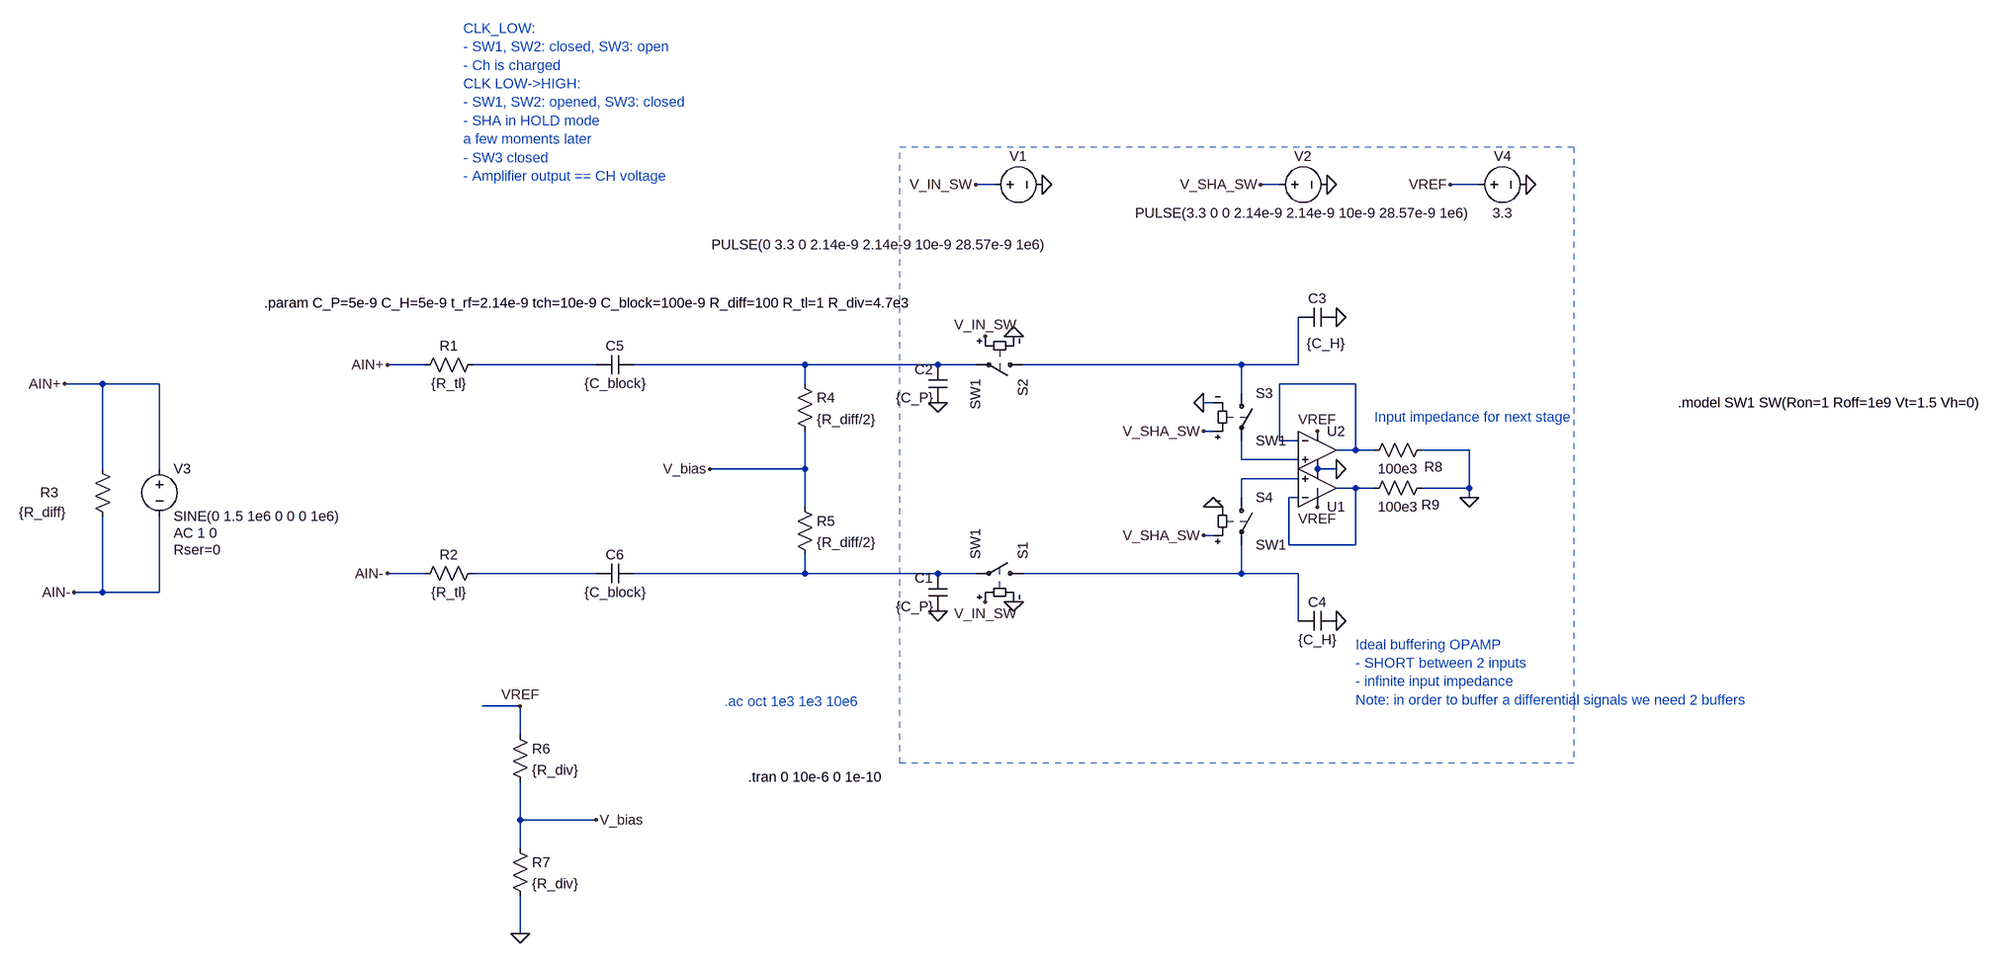
[diagram p0: schematic adc_analog_input.asc]
adc_analog_input.asc, the LTspice schematic file:
Version 4
SHEET 1 1884 948
WIRE 48 -384 16 -384
WIRE 528 -384 496 -384
WIRE 864 -384 816 -384
WIRE -912 -80 -976 -80
WIRE -624 -80 -832 -80
WIRE -272 -80 -560 -80
WIRE -48 -80 -272 -80
WIRE 16 -80 -48 -80
WIRE 464 -80 96 -80
WIRE 560 -80 560 -160
WIRE 560 -80 464 -80
WIRE -1456 -48 -1520 -48
WIRE -1360 -48 -1456 -48
WIRE -272 -48 -272 -80
WIRE 656 -48 528 -48
WIRE 464 -32 464 -80
WIRE 416 -16 400 -16
WIRE 416 32 400 32
WIRE 528 48 528 -48
WIRE 560 48 528 48
WIRE 656 64 656 -48
WIRE 656 64 624 64
WIRE 688 64 656 64
WIRE 848 64 768 64
WIRE 464 80 464 48
WIRE 560 80 464 80
WIRE -1456 96 -1456 -48
WIRE -1360 96 -1360 -48
WIRE -272 96 -272 32
WIRE -272 96 -432 96
WIRE 624 96 592 96
WIRE 560 112 464 112
WIRE 656 128 624 128
WIRE 688 128 656 128
WIRE 848 128 848 64
WIRE 848 128 768 128
WIRE 464 144 464 112
WIRE 560 144 544 144
WIRE 848 144 848 128
WIRE -272 160 -272 96
WIRE 592 160 592 128
WIRE 416 208 400 208
WIRE 544 224 544 144
WIRE 656 224 656 128
WIRE 656 224 544 224
WIRE -912 272 -976 272
WIRE -624 272 -832 272
WIRE -272 272 -272 240
WIRE -272 272 -560 272
WIRE -48 272 -272 272
WIRE 16 272 -48 272
WIRE 464 272 464 224
WIRE 464 272 96 272
WIRE 560 272 464 272
WIRE -1456 304 -1456 176
WIRE -1456 304 -1504 304
WIRE -1360 304 -1360 176
WIRE -1360 304 -1456 304
WIRE 560 352 560 272
WIRE -752 496 -816 496
WIRE -752 544 -752 496
WIRE -752 688 -752 624
WIRE -624 688 -752 688
WIRE -752 736 -752 688
WIRE -752 880 -752 816
FLAG -976 -80 AIN+
FLAG -976 272 AIN-
FLAG -48 336 0
FLAG -48 -16 0
FLAG 80 -128 0
FLAG 80 320 0
FLAG 32 -128 V_IN_SW
FLAG 32 320 V_IN_SW
FLAG 128 -384 0
FLAG 16 -384 V_IN_SW
FLAG 608 -384 0
FLAG 496 -384 V_SHA_SW
FLAG 400 -16 0
FLAG 400 32 V_SHA_SW
FLAG 624 -160 0
FLAG 624 352 0
FLAG -1520 -48 AIN+
FLAG -1504 304 AIN-
FLAG -752 880 0
FLAG -624 688 V_bias
FLAG -432 96 V_bias
FLAG 944 -384 0
FLAG 816 -384 VREF
FLAG -752 496 VREF
FLAG 624 96 0
FLAG 848 144 0
FLAG 400 208 V_SHA_SW
FLAG 416 160 0
FLAG 592 160 VREF
FLAG 592 32 VREF
DATAFLAG 816 64 ""
SYMBOL sw 112 272 M270
SYMATTR InstName S1
SYMATTR Value SW1
SYMBOL sw 112 -80 R90
SYMATTR InstName S2
SYMATTR Value SW1
SYMBOL voltage 32 -384 R270
WINDOW 0 32 56 VTop 2
WINDOW 3 -117 -178 VTop 2
WINDOW 123 0 0 Left 0
WINDOW 39 0 0 Left 0
SYMATTR InstName V1
SYMATTR Value PULSE(0 3.3 0 2.14e-9 2.14e-9 10e-9 28.57e-9 1e6)
SYMBOL cap -32 336 R180
WINDOW 0 24 56 Left 2
WINDOW 3 24 8 Left 2
SYMATTR InstName C1
SYMATTR Value {C_P}
SYMBOL cap -32 -16 R180
WINDOW 0 24 56 Left 2
WINDOW 3 24 8 Left 2
SYMATTR InstName C2
SYMATTR Value {C_P}
SYMBOL voltage 512 -384 R270
WINDOW 0 32 56 VTop 2
WINDOW 3 -32 56 VBottom 2
WINDOW 123 0 0 Left 0
WINDOW 39 0 0 Left 0
SYMATTR InstName V2
SYMATTR Value PULSE(3.3 0 0 2.14e-9 2.14e-9 10e-9 28.57e-9 1e6)
SYMBOL sw 464 -48 R0
SYMATTR InstName S3
SYMATTR Value SW1
SYMBOL cap 624 -176 R90
WINDOW 0 0 32 VBottom 2
WINDOW 3 44 18 VTop 2
SYMATTR InstName C3
SYMATTR Value {C_H}
SYMBOL cap 624 336 R90
WINDOW 0 0 32 VBottom 2
WINDOW 3 32 32 VTop 2
SYMATTR InstName C4
SYMATTR Value {C_H}
SYMBOL voltage -1360 80 R0
WINDOW 123 24 124 Left 2
WINDOW 39 24 152 Left 2
SYMATTR Value2 AC 1 0
SYMATTR SpiceLine Rser=0
SYMATTR InstName V3
SYMATTR Value SINE(0 1.5 1e6 0 0 0 1e6)
SYMBOL res -816 -96 R90
WINDOW 0 0 56 VBottom 2
WINDOW 3 32 56 VTop 2
SYMATTR InstName R1
SYMATTR Value {R_tl}
SYMBOL res -816 256 R90
WINDOW 0 0 56 VBottom 2
WINDOW 3 32 56 VTop 2
SYMATTR InstName R2
SYMATTR Value {R_tl}
SYMBOL res -1472 80 R0
WINDOW 0 -89 56 Left 2
WINDOW 3 -125 89 Left 2
SYMATTR InstName R3
SYMATTR Value {R_diff}
SYMBOL res -288 -64 R0
SYMATTR InstName R4
SYMATTR Value {R_diff/2}
SYMBOL cap -560 -96 R90
WINDOW 0 0 32 VBottom 2
WINDOW 3 32 32 VTop 2
SYMATTR InstName C5
SYMATTR Value {C_block}
SYMBOL cap -560 256 R90
WINDOW 0 0 32 VBottom 2
WINDOW 3 32 32 VTop 2
SYMATTR InstName C6
SYMATTR Value {C_block}
SYMBOL res -288 144 R0
SYMATTR InstName R5
SYMATTR Value {R_diff/2}
SYMBOL res -768 528 R0
SYMATTR InstName R6
SYMATTR Value {R_div}
SYMBOL res -768 720 R0
SYMATTR InstName R7
SYMATTR Value {R_div}
SYMBOL OpAmps\\UniversalOpAmp 592 64 R0
SYMATTR InstName U2
SYMATTR Value2 Avol=1000 GBW=2e20 Vos=0
SYMBOL voltage 848 -384 R270
WINDOW 0 32 56 VTop 2
WINDOW 3 -32 56 VBottom 2
WINDOW 123 0 0 Left 0
WINDOW 39 0 0 Left 0
SYMATTR InstName V4
SYMATTR Value 3.3
SYMBOL res 784 48 R90
WINDOW 0 60 -4 VBottom 2
WINDOW 3 32 56 VTop 2
SYMATTR InstName R8
SYMATTR Value 100e3
SYMBOL sw 464 128 R0
SYMATTR InstName S4
SYMATTR Value SW1
SYMBOL OpAmps\\UniversalOpAmp 592 128 M180
SYMATTR InstName U1
SYMATTR Value2 Avol=1000 GBW=2e20 Vos=0
SYMBOL res 784 112 R90
WINDOW 0 60 1 VBottom 2
WINDOW 3 32 56 VTop 2
SYMATTR InstName R9
SYMATTR Value 100e3
TEXT -1184 -184 Left 2 !.param C_P=5e-9 C_H=5e-9 t_rf=2.14e-9 tch=10e-9 C_block=100e-9 R_diff=100 R_tl=1 R_div=4.7e3
TEXT -368 616 Left 2 !.tran 0 10e-6 0 1e-10
TEXT -848 -648 Left 2 ;CLK_LOW:\n- SW1, SW2: closed, SW3: open\n- Ch is charged\nCLK LOW->HIGH:\n- SW1, SW2: opened, SW3: closed\n- SHA in HOLD mode\na few moments later\n- SW3 closed\n- Amplifier output == CH voltage
TEXT 1200 -16 Left 2 !.model SW1 SW(Ron=1 Roff=1e9 Vt=1.5 Vh=0)
TEXT 656 392 Left 2 ;Ideal buffering OPAMP \n- SHORT between 2 inputs\n- infinite input impedance\nNote: in order to buffer a differential signals we need 2 buffers
TEXT 688 8 Left 2 ;Input impedance for next stage
TEXT -408 488 Left 2 ;.ac oct 1e3 1e3 10e6
RECTANGLE Normal 1024 592 -112 -448 2

The netlist it stands for:
* adc_analog_input.asc
S1 N010 N009 V_IN_SW 0 SW1
S2 N003 N002 V_IN_SW 0 SW1
V1 V_IN_SW 0 PULSE(0 3.3 0 2.14e-9 2.14e-9 10e-9 28.57e-9 1e6)
C1 0 N009 {C_P}
C2 0 N002 {C_P}
V2 V_SHA_SW 0 PULSE(3.3 0 0 2.14e-9 2.14e-9 10e-9 28.57e-9 1e6)
S3 N003 N005 V_SHA_SW 0 SW1
C3 0 N003 {C_H}
C4 0 N010 {C_H}
V3 AIN+ AIN- SINE(0 1.5 1e6 0 0 0 1e6) AC 1 0 Rser=0
R1 N001 AIN+ {R_tl}
R2 N008 AIN- {R_tl}
R3 AIN+ AIN- {R_diff}
R4 N002 V_bias {R_diff/2}
C5 N002 N001 {C_block}
C6 N009 N008 {C_block}
R5 V_bias N009 {R_diff/2}
R6 VREF V_bias {R_div}
R7 V_bias 0 {R_div}
XU2 N005 N004 VREF 0 N004 level1 Avol=1000 GBW=2e20 Vos=0 En=0 Enk=0 In=0 Ink=0 Rin=500Meg  ; pins In+ In- V+ V- OUT
V4 VREF 0 3.3
R8 0 N004 100e3
S4 N006 N010 V_SHA_SW 0 SW1
XU1 N006 N007 VREF 0 N007 level1 Avol=1000 GBW=2e20 Vos=0 En=0 Enk=0 In=0 Ink=0 Rin=500Meg  ; pins In+ In- V+ V- OUT
R9 0 N007 100e3
.param C_P=5e-9 C_H=5e-9 t_rf=2.14e-9 tch=10e-9 C_block=100e-9 R_diff=100 R_tl=1 R_div=4.7e3
.tran 0 10e-6 0 1e-10
* CLK_LOW:
* - SW1, SW2: closed, SW3: open
* - Ch is charged
* CLK LOW->HIGH:
* - SW1, SW2: opened, SW3: closed
* - SHA in HOLD mode
* a few moments later
* - SW3 closed
* - Amplifier output == CH voltage
.model SW1 SW(Ron=1 Roff=1e9 Vt=1.5 Vh=0)
* Ideal buffering OPAMP
* - SHORT between 2 inputs
* - infinite input impedance
* Note: in order to buffer a differential signals we need 2 buffers
* Input impedance for next stage
* .ac oct 1e3 1e3 10e6
.lib UniversalOpAmp1.lib
.backanno
.end